# Altium schematic sheet EV76C661_Sheet.SchDoc
size 420 x 297 mm; Address1: Address1; Address2: Address2; Address3: Address3; Address4: Address4; DocumentNumber: Мезонин EV76C661; SheetNumber: 1; Scale: 1:1; DocumentType: Схема электрическая принципиальная; FirstReferrence: АБВГ.123456.001
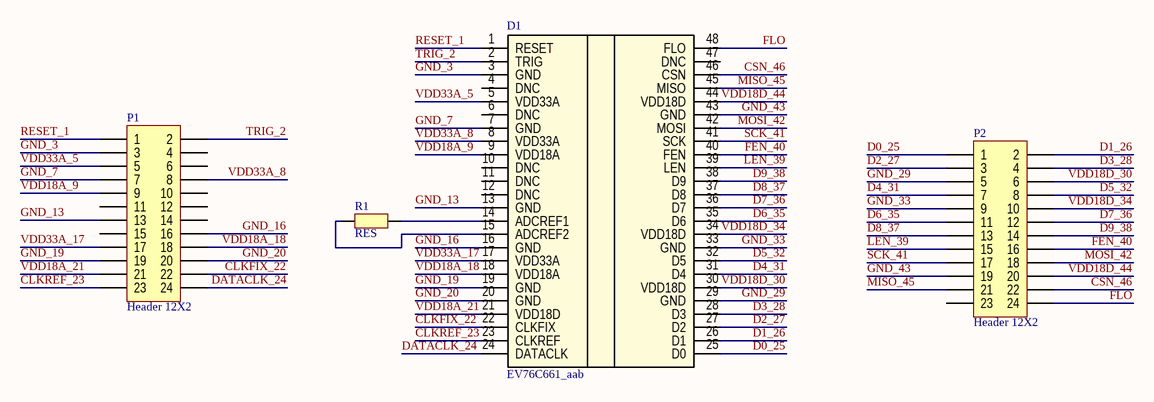
[diagram p0: EV76C661_Sheet.SchDoc]

## Parts
D1  EV76C661_aab  [EV76C611_aab]
P1  Header 12X2  [HDR2X12]
P2  Header 12X2  [HDR2X12]
R1  RES  [RES]

## Nets
CLKFIX_22: D1.22(CLKFIX) P1.22
CLKREF_23: D1.23(CLKREF) P1.23
CSN_46: D1.46(CSN) P2.22
D0_25: D1.25(D0) P2.1
D1_26: D1.26(D1) P2.2
D2_27: D1.27(D2) P2.3
D3_28: D1.28(D3) P2.4
D4_31: D1.31(D4) P2.7
D5_32: D1.32(D5) P2.8
D6_35: D1.35(D6) P2.11
D7_36: D1.36(D7) P2.12
D8_37: D1.37(D8) P2.13
D9_38: D1.38(D9) P2.14
DATACLK_24: D1.24(DATACLK) P1.24
FEN_40: D1.40(FEN) P2.16
FLO: D1.48(FLO) P2.24
GND_3: D1.3(GND) P1.3
GND_7: D1.7(GND) P1.7
GND_13: D1.13(GND) P1.13
GND_16: D1.16(GND) P1.16
GND_19: D1.19(GND) P1.19
GND_20: D1.20(GND) P1.20
GND_29: D1.29(GND) P2.5
GND_33: D1.33(GND) P2.9
GND_43: D1.43(GND) P2.19
LEN_39: D1.39(LEN) P2.15
MISO_45: D1.45(MISO) P2.21
MOSI_42: D1.42(MOSI) P2.18
RESET_1: D1.1(RESET) P1.1
SCK_41: D1.41(SCK) P2.17
TRIG_2: D1.2(TRIG) P1.2
VDD18A_9: D1.9(VDD18A) P1.9
VDD18A_18: D1.18(VDD18A) P1.18
VDD18A_21: D1.21(VDD18D) P1.21
VDD18D_30: D1.30(VDD18D) P2.6
VDD18D_34: D1.34(VDD18D) P2.10
VDD18D_44: D1.44(VDD18D) P2.20
VDD33A_5: D1.5(VDD33A) P1.5
VDD33A_8: D1.8(VDD33A) P1.8
VDD33A_17: D1.17(VDD33A) P1.17
NetD1_14: D1.14(ADCREF1) R1.2
NetD1_15: D1.15(ADCREF2) R1.1

Not connected (* = marked no-connect by the designer): D1 4(DNC) 6(DNC) 10(DNC) 11(DNC) 12(DNC) 47(DNC); P1 4 6 10 11 12 14 15; P2 23

## Notes on the sheet
- Перв. примен.
- Справ. №
- Подп. и дата
- Инв. № дубл.
- Взам. инв. №
- Разраб.
- Изм.
- Лист
- № докум.
- Подп.
- Дата
- Лит.
- Масса
- Масштаб
- Пров.
- Т.контр.
- Листов
- Инв. № подл.
- Утв.
- Н.контр.
- 2.106-A3
- Копировал
- Формат А3

## Library data of the parts
P1 P2 = Header 12X2: Header, 12-Pin, Dual row; LatestRevisionDate: 17-Jul-2002; LatestRevisionNote: Re-released for DXP Platform.; Publisher: Altium Limited